# Altium schematic sheet percepcao_externa_official.SchDoc
size A4; SheetNumber: 1; SheetTotal: 4
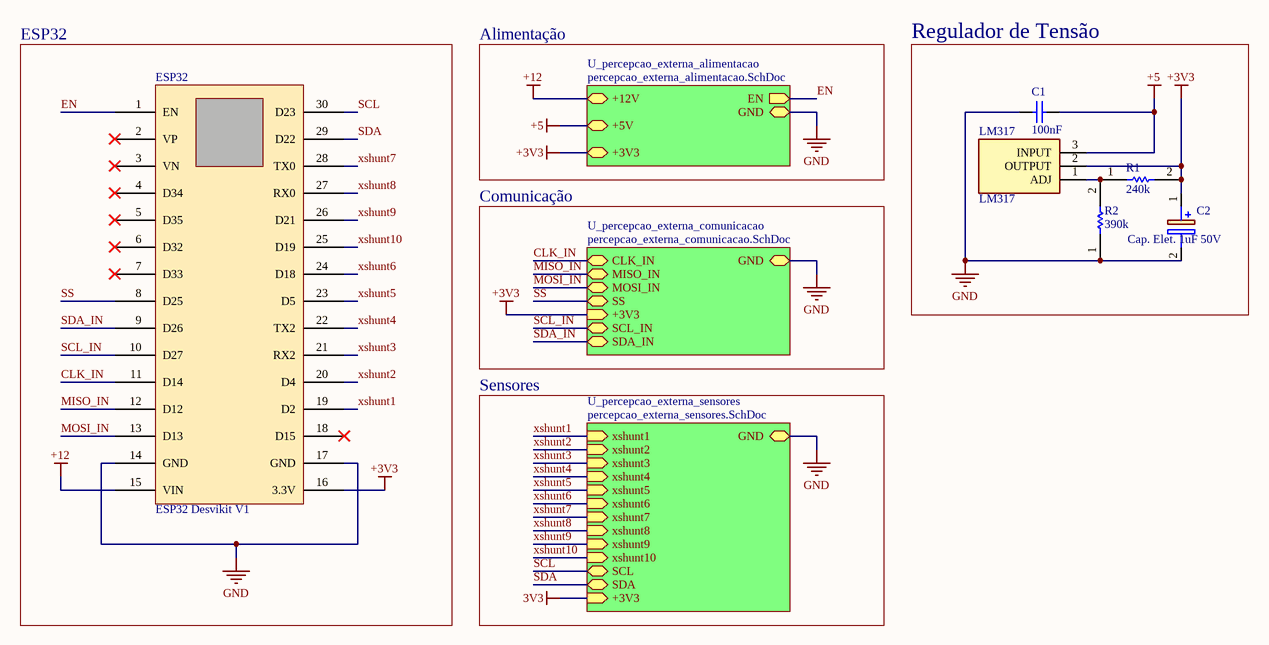
[diagram p0: percepcao_externa_official.SchDoc]

## Parts
C1  100nF  [CAP CER DISK 10uF 50V]
C2  Cap. Elet. 1uF 50V  [Cap. Elet. 470uF 16V]
ESP32  value ESP32 Desvikit V1  [ESP32_Desvikit_v1]  (hidden comment: microcontrolador)
LM317  LM317  [TO254P467X1016X1971-3P]
R1  240k  [RESC3216X60N]
R2  390k  [RESC3216X60N]

## Blocks framed on the sheet
ESP32: ESP32
Regulador de Tensão: C1 C2 LM317 R1 R2

## Sub-sheets
U_percepcao_externa_alimentacao = percepcao_externa_alimentacao.SchDoc: EN (out), GND (bidir), +12V (bidir), +5V (bidir), +3V3 (bidir)
U_percepcao_externa_comunicacao = percepcao_externa_comunicacao.SchDoc: CLK_IN (bidir), MISO_IN (bidir), MOSI_IN (bidir), SS (bidir), GND (bidir), +3V3 (in), SCL_IN (bidir), SDA_IN (bidir)
U_percepcao_externa_sensores = percepcao_externa_sensores.SchDoc: xshunt1 (in), xshunt2 (in), xshunt3 (in), xshunt4 (in), xshunt5 (in), xshunt6 (in), xshunt7 (in), xshunt8 (in), xshunt9 (in), xshunt10 (in), SCL (bidir), SDA (bidir), GND (bidir), +3V3 (in)

## Nets
3V3: sheet U_percepcao_externa_sensores/+3V3
+3V3: C2.1(+) ESP32.16(3.3V) LM317.2(OUTPUT) R1.2 ; sheet U_percepcao_externa_alimentacao/+3V3, sheet U_percepcao_externa_comunicacao/+3V3
+5: C1.2 LM317.3(INPUT) ; sheet U_percepcao_externa_alimentacao/+5V
+12: ESP32.15(VIN) ; sheet U_percepcao_externa_alimentacao/+12V
GND: C1.1 C2.2(-) ESP32.14(GND) ESP32.17(GND) R2.1 ; sheet U_percepcao_externa_alimentacao/GND, sheet U_percepcao_externa_sensores/GND, sheet U_percepcao_externa_comunicacao/GND
CLK_IN: ESP32.11(D14) ; sheet U_percepcao_externa_comunicacao/CLK_IN
EN: ESP32.1(EN) ; sheet U_percepcao_externa_alimentacao/EN
MISO_IN: ESP32.12(D12) ; sheet U_percepcao_externa_comunicacao/MISO_IN
MOSI_IN: ESP32.13(D13) ; sheet U_percepcao_externa_comunicacao/MOSI_IN
SCL: ESP32.30(D23) ; sheet U_percepcao_externa_sensores/SCL
SCL_IN: ESP32.10(D27) ; sheet U_percepcao_externa_comunicacao/SCL_IN
SDA: ESP32.29(D22) ; sheet U_percepcao_externa_sensores/SDA
SDA_IN: ESP32.9(D26) ; sheet U_percepcao_externa_comunicacao/SDA_IN
SS: ESP32.8(D25) ; sheet U_percepcao_externa_comunicacao/SS
xshunt1: ESP32.19(D2) ; sheet U_percepcao_externa_sensores/xshunt1
xshunt2: ESP32.20(D4) ; sheet U_percepcao_externa_sensores/xshunt2
xshunt3: ESP32.21(RX2) ; sheet U_percepcao_externa_sensores/xshunt3
xshunt4: ESP32.22(TX2) ; sheet U_percepcao_externa_sensores/xshunt4
xshunt5: ESP32.23(D5) ; sheet U_percepcao_externa_sensores/xshunt5
xshunt6: ESP32.24(D18) ; sheet U_percepcao_externa_sensores/xshunt6
xshunt7: ESP32.28(TX0) ; sheet U_percepcao_externa_sensores/xshunt7
xshunt8: ESP32.27(RX0) ; sheet U_percepcao_externa_sensores/xshunt8
xshunt9: ESP32.26(D21) ; sheet U_percepcao_externa_sensores/xshunt9
xshunt10: ESP32.25(D19) ; sheet U_percepcao_externa_sensores/xshunt10
NetLM317_1: LM317.1(ADJ) R1.1 R2.2

Not connected (* = marked no-connect by the designer): ESP32 2(VP)* 3(VN)* 4(D34)* 5(D35)* 6(D32)* 7(D33)* 18(D15)*

## Notes on the sheet
- Alimentação
- Comunicação
- Sensores

## Library data of the parts
C1 = CAP CER DISK 10uF 50V_1: CAP CER DISK 10uF 50V; Manufacturer Part Number: IMP14925; Product Range: MCFY Series; Capacitance: 0.1uF; Capacitance Tolerance: +80%, -20%; Dielectric Characteristic: Y5; Voltage Rating: 50; Capacitor Terminals: Radial Leaded; SVHC: No SVHC (15-Jun-2015); Supplier 1: Mult Comercial; Manufacturer: -; RoHS: YES; Stock 1: 115809; Pricing 1: 1=0.10 (BRL); Packaging: Each; Lead Spacing: 5; Operating Temperature Min: -25; Operating Temperature Max: 85; Capacitance Tolerance ±: +80%, -20%; Operating Temperature Range: -25°C to +85°C<!--FANDB--><div class="features-and-benefits-container"><div class="features-and-benefits-description"><span class="features-benefits-value">The MCFY series from Multicomp are radial leaded ceramic disc capacitors. The capacitance values ranges from 6800pF to 0.22?F.</span></div><div class="features-and-benefits-list"><ul class="features-and-benefits-list-list"><li class="features-and-benefits-list-item">Large capacitance in small size</li><li class="features-and-benefits-list-item">Rated voltage of 50V</li><li class="features-and-benefits-list-item">80%/-20% tolerance</li><li class="features-and-benefits-list-item">Operating temperature range -25°C to +85; ComponentLink1URL: http://loja.multcomercial.com.br/capacitor-ceramico-disco-100kpf-50v-104-100k-100nf-0-1uf-cod-1351.html; ComponentLink1Description: http://loja.multcomercial.com.br/capacitor-ceramico-disco-100kpf-50v-104-100k-100nf-0-1uf-cod-1351.html; Supplier Part Number 1: Capacitor Cerâmico Disco 100Kpf/50V (104/100K/100nF/0.1uF) cód. 1351
C2 = Cap. Elet. 470 uF 16V: Aluminum Organic Polymer Capacitors 16volts 470uF ESR 10mohm; Manufacturer_Name: Panasonic; Manufacturer_Part_Number: 16SEPC470M; Datasheet Link: http://industrial.panasonic.com/www-cgi/jvcr13pz.cgi?E+CI+4+AAB8010+16SEPC470M+8+WW; Height: 13mm; Mouser Part Number: 667-16SEPC470M; Mouser Price/Stock: https://www.mouser.co.uk/ProductDetail/Panasonic/16SEPC470M?qs=OE1iw1LrrPEdZuWyF2l%252B5w%3D%3D; Arrow Part Number: 16SEPC470M; Arrow Price/Stock: https://www.arrow.com/en/products/16sepc470m/panasonic
ESP32 = ESP32 Desvikit v1: microcontrolador com moculo bluethoth e wifi
LM317 = LM317: Integrated Circuit; Manufacturer_Name: Changjiang Electronics Tech (CJ); Datasheet Link: https://datasheet.lcsc.com/szlcsc/Changjiang-Electronics-Tech-CJ-LM317_C22147.pdf; Height: 4.67mm; Manufacturer_Part_Number: LM317
R1 R2 = RES 1206: RES 1206 5%; Manufacturer_Name: Vishay; Manufacturer_Part_Number: CRCW12064K70FKEA; Datasheet Link: http://docs-emea.rs-online.com/webdocs/13ec/0900766b813ecc08.pdf; Height: 0.6mm; Mouser Part Number: 71-CRCW1206-4.7K-E3; Mouser Price/Stock: https://www.mouser.co.uk/ProductDetail/Vishay-Dale/CRCW12064K70FKEA?qs=1vm4qhDHCvlKJmatsKzyFQ%3D%3D; Arrow Part Number: CRCW12064K70FKEA; Arrow Price/Stock: https://www.arrow.com/en/products/crcw12064k70fkea/vishay